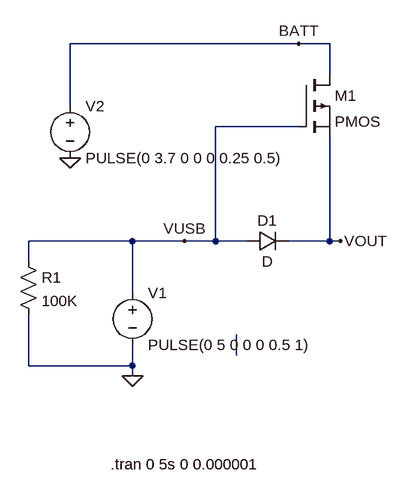
[diagram p0: schematic Draft2.asc]
Draft2.asc, the LTspice schematic file:
Version 4
SHEET 1 880 680
WIRE 16 -272 -336 -272
WIRE 64 -272 16 -272
WIRE 64 -224 64 -272
WIRE -336 -176 -336 -272
WIRE 16 -144 -112 -144
WIRE -240 32 -400 32
WIRE -160 32 -240 32
WIRE -112 32 -112 -144
WIRE -112 32 -160 32
WIRE -64 32 -112 32
WIRE 64 32 64 -128
WIRE 64 32 0 32
WIRE 80 32 64 32
WIRE -400 64 -400 32
WIRE -240 112 -240 32
WIRE -80 208 -80 176
WIRE -400 224 -400 144
WIRE -240 224 -240 192
WIRE -240 224 -400 224
WIRE -240 240 -240 224
FLAG -240 240 0
FLAG -160 32 VUSB
FLAG -336 -96 0
FLAG 80 32 VOUT
FLAG 16 -272 BATT
SYMBOL diode -64 48 R270
WINDOW 0 32 32 VTop 2
WINDOW 3 0 32 VBottom 2
SYMATTR InstName D1
SYMBOL voltage -240 96 R0
WINDOW 123 0 0 Left 0
WINDOW 39 0 0 Left 0
SYMATTR InstName V1
SYMATTR Value PULSE(0 5 0 0 0 0.5 1)
SYMBOL pmos 16 -224 R0
SYMATTR InstName M1
SYMBOL voltage -336 -192 R0
WINDOW 123 0 0 Left 0
WINDOW 39 0 0 Left 0
SYMATTR InstName V2
SYMATTR Value PULSE(0 3.7 0 0 0 0.25 0.5)
SYMBOL res -416 48 R0
SYMATTR InstName R1
SYMATTR Value 100K
TEXT -274 376 Left 2 !.tran 0 5s 0 0.000001

The netlist it stands for:
* Draft2.asc
D1 VUSB VOUT D
V1 VUSB 0 PULSE(0 5 0 0 0 0.5 1)
M1 BATT VUSB VOUT VOUT PMOS
V2 BATT 0 PULSE(0 3.7 0 0 0 0.25 0.5)
R1 VUSB 0 100K
.model D D
.lib standard.dio
.model NMOS NMOS
.model PMOS PMOS
.lib standard.mos
.tran 0 5s 0 0.000001
.backanno
.end